# EAGLE design OwlModular (EAGLE 7.5.0)
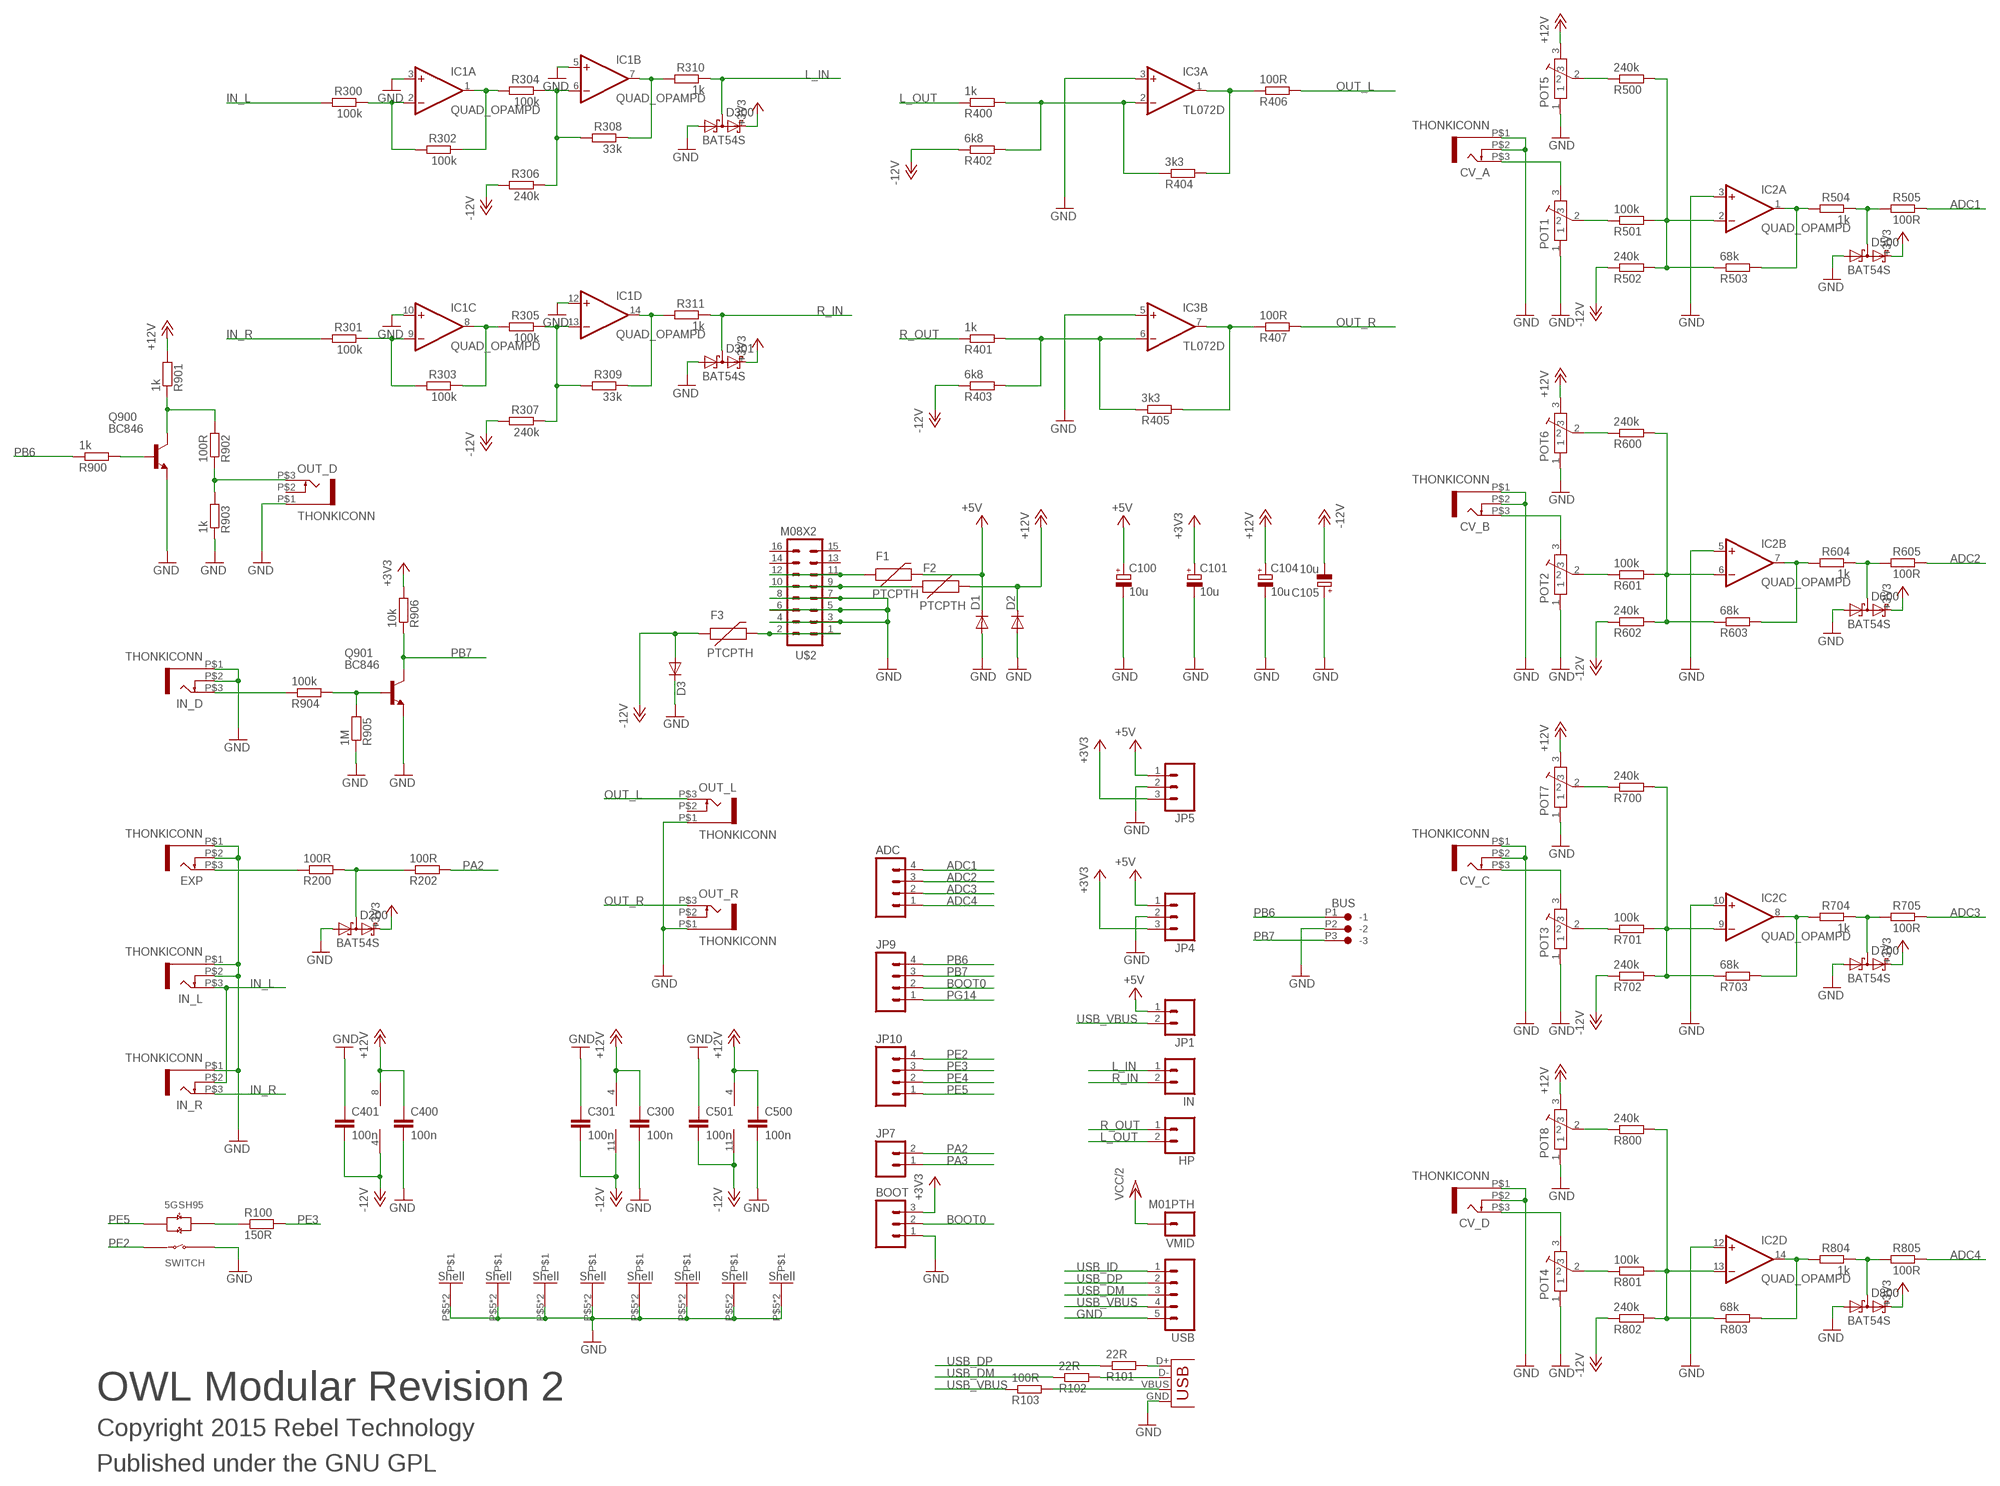
[diagram p0: schematic, sheet 1]

## Parts
ADC  M04PTH  [1X04]
BOOT  M03PTH  [1X03]
BUS  CON-JST_PH_3W  [CON-JST_PH_3W]
C100  10u  CPOL-EUA  [PANASONIC_A]
C101  10u  CPOL-EUA  [PANASONIC_A]
C104  10u  CPOL-EUA  [PANASONIC_A]
C105  10u  CPOL-EUA  [PANASONIC_A]
C300  100n  C-EUC0603  [C0603]
C301  100n  C-EUC0603  [C0603]
C400  100n  C-EUC0603  [C0603]
C401  100n  C-EUC0603  [C0603]
C500  100n  C-EUC0603  [C0603]
C501  100n  C-EUC0603  [C0603]
CV_A  THONKICONN  [THONKICONN]
CV_B  THONKICONN  [THONKICONN]
CV_C  THONKICONN  [THONKICONN]
CV_D  THONKICONN  [THONKICONN]
D1  DIODE1N4001  [DIODE-1N4001]
D2  DIODE1N4001  [DIODE-1N4001]
D3  DIODE1N4001  [DIODE-1N4001]
D200  BAT54S  [SOT23]
D300  BAT54S  [SOT23]
D301  BAT54S  [SOT23]
D500  BAT54S  [SOT23]
D600  BAT54S  [SOT23]
D700  BAT54S  [SOT23]
D800  BAT54S  [SOT23]
EXP  THONKICONN  [THONKICONN]
F1  PTCPTH  [PTC]
F2  PTCPTH  [PTC]
F3  PTCPTH  [PTC]
HP  M02PTH  [1X02]
IC1  QUAD_OPAMPD  [SO14]
IC2  QUAD_OPAMPD  [SO14]
IC3  TL072D  [SO08]
IN  M02PTH  [1X02]
IN_D  THONKICONN  [THONKICONN]
IN_L  THONKICONN  [THONKICONN]
IN_R  THONKICONN  [THONKICONN]
JP1  M02PTH  [1X02]
JP4  M03PTH  [1X03]
JP5  M03PTH  [1X03]
JP7  M02PTH  [1X02]
JP9  M04PTH  [1X04]
JP10  M04PTH  [1X04]
OUT_D  THONKICONN  [THONKICONN]
OUT_L  THONKICONN  [THONKICONN]
OUT_R  THONKICONN  [THONKICONN]
POT1  POT-ALPS-RK09L1140  [POT-ALPS-RK09L1140]
POT2  POT-ALPS-RK09L1140  [POT-ALPS-RK09L1140]
POT3  POT-ALPS-RK09L1140  [POT-ALPS-RK09L1140]
POT4  POT-ALPS-RK09L1140  [POT-ALPS-RK09L1140]
POT5  POT-ALPS-RK09L1140  [POT-ALPS-RK09L1140]
POT6  POT-ALPS-RK09L1140  [POT-ALPS-RK09L1140]
POT7  POT-ALPS-RK09L1140  [POT-ALPS-RK09L1140]
POT8  POT-ALPS-RK09L1140  [POT-ALPS-RK09L1140]
Q900  BC846  [SOT23]
Q901  BC846  [SOT23]
R100  150R  R-EU_0603  [0603]
R101  22R  R-EU_0603  [0603]
R102  22R  R-EU_0603  [0603]
R103  100R  R-EU_0603  [0603]
R200  100R  R-EU_0603  [0603]
R202  100R  R-EU_0603  [0603]
R300  100k  R-EU_0603  [0603]
R301  100k  R-EU_0603  [0603]
R302  100k  R-EU_0603  [0603]
R303  100k  R-EU_0603  [0603]
R304  100k  R-EU_0603  [0603]
R305  100k  R-EU_0603  [0603]
R306  240k  R-EU_0603  [0603]
R307  240k  R-EU_0603  [0603]
R308  33k  R-EU_0603  [0603]
R309  33k  R-EU_0603  [0603]
R310  1k  R-EU_0603  [0603]
R311  1k  R-EU_0603  [0603]
R400  1k  R-EU_0603  [0603]
R401  1k  R-EU_0603  [0603]
R402  6k8  R-EU_0603  [0603]
R403  6k8  R-EU_0603  [0603]
R404  3k3  R-EU_0603  [0603]
R405  3k3  R-EU_0603  [0603]
R406  100R  R-EU_0603  [0603]
R407  100R  R-EU_0603  [0603]
R500  240k  R-EU_0603  [0603]
R501  100k  R-EU_0603  [0603]
R502  240k  R-EU_0603  [0603]
R503  68k  R-EU_0603  [0603]
R504  1k  R-EU_0603  [0603]
R505  100R  R-EU_0603  [0603]
R600  240k  R-EU_0603  [0603]
R601  100k  R-EU_0603  [0603]
R602  240k  R-EU_0603  [0603]
R603  68k  R-EU_0603  [0603]
R604  1k  R-EU_0603  [0603]
R605  100R  R-EU_0603  [0603]
R700  240k  R-EU_0603  [0603]
R701  100k  R-EU_0603  [0603]
R702  240k  R-EU_0603  [0603]
R703  68k  R-EU_0603  [0603]
R704  1k  R-EU_0603  [0603]
R705  100R  R-EU_0603  [0603]
R800  240k  R-EU_0603  [0603]
R801  100k  R-EU_0603  [0603]
R802  240k  R-EU_0603  [0603]
R803  68k  R-EU_0603  [0603]
R804  1k  R-EU_0603  [0603]
R805  100R  R-EU_0603  [0603]
R900  1k  R-EU_0603  [0603]
R901  1k  R-EU_0603  [0603]
R902  100R  R-EU_0603  [0603]
R903  1k  R-EU_0603  [0603]
R904  100k  R-EU_0603  [0603]
R905  1M  R-EU_0603  [0603]
R906  10k  R-EU_0603  [0603]
U$1  5GTH9  [5GTH9]
U$2  M08X2  [2X8]
USB  M05PTH  [1X05]
VMID  M01PTH  [1X01]
X1  USBPTH-VERTICAL  [USB-B-PTH-VERTICAL]

## Nets
+3V3: BOOT.3 C101.+ D200.2(C2) D300.2(C2) D301.2(C2) D500.2(C2) D600.2(C2) D700.2(C2) D800.2(C2) JP4.3 JP5.3 R906.2
+5V: C100.+ D1.C F1.P$2 JP1.1 JP4.1 JP5.1
+12V: C104.+ C300.1 C400.1 C500.1 D2.C F2.P$2 IC1.4(P:V+) IC2.4(P:V+) IC3.8(P:V+) POT5.3 POT6.3 POT7.3 POT8.3 R901.2
-12V: C105.- C301.2 C401.2 C501.2 D3.A F3.P$1 IC1.11(P:V-) IC2.11(P:V-) IC3.4(P:V-) R306.2 R307.2 R402.1 R403.1 R502.1 R602.1 R702.1 R802.1
ADC1: ADC.4 R505.1
ADC2: ADC.3 R605.1
ADC3: ADC.2 R705.1
ADC4: ADC.1 R805.1
BOOT0: BOOT.2 JP9.2
GND: BOOT.1 BUS.P2(-2) C100.- C101.- C104.- C105.+ C300.2 C301.1 C400.2 C401.1 C500.2 C501.1 CV_A.P$1 CV_A.P$2 CV_B.P$1 CV_B.P$2 CV_C.P$1 CV_C.P$2 CV_D.P$1 CV_D.P$2 D1.A D2.A D3.C D200.1(A1) D300.1(A1) D301.1(A1) D500.1(A1) D600.1(A1) D700.1(A1) D800.1(A1) EXP.P$1 EXP.P$2 IC1.3(A:+IN) IC1.5(B:+IN) IC1.10(C:+IN) IC1.12(D:+IN) IC2.3(A:+IN) IC2.5(B:+IN) IC2.10(C:+IN) IC2.12(D:+IN) IC3.3(A:+IN) IC3.5(B:+IN) IN_D.P$1 IN_D.P$2 IN_L.P$1 IN_L.P$2 IN_R.P$1 JP4.2 JP5.2 OUT_D.P$1 OUT_L.P$1 OUT_R.P$1 POT1.1 POT1.P$5 POT1.P$6 POT2.1 POT2.P$5 POT2.P$6 POT3.1 POT3.P$5 POT3.P$6 POT4.1 POT4.P$5 POT4.P$6 POT5.1 POT5.P$5 POT5.P$6 POT6.1 POT6.P$5 POT6.P$6 POT7.1 POT7.P$5 POT7.P$6 POT8.1 POT8.P$5 POT8.P$6 Q900.2(E) Q901.2(E) R903.1 R905.1 U$1.1(SWITCH_B) U$2.3 U$2.4 U$2.5 U$2.6 U$2.7 U$2.8 USB.5 X1.GND
IN_L: IN_L.P$3 IN_R.P$2 R300.2
IN_R: IN_R.P$3 R301.2
L_IN: D300.3(C1A2) IN.1 R310.1
L_OUT: HP.2 R400.1
N$1: IC1.1(A:OUT) R302.1 R304.2
N$2: CV_A.P$3 POT1.3
N$3: POT1.2 R501.1
N$4: IC1.8(C:OUT) R303.1 R305.2
N$5: IC1.9(C:-IN) R301.1 R303.2
N$6: F3.P$2 U$2.1 U$2.2
N$7: IC1.13(D:-IN) R305.1 R307.1 R309.2
N$9: IC1.2(A:-IN) R300.1 R302.2
N$10: R100.1 U$1.+3(LED_R+)
N$12: D200.3(C1A2) R200.2 R202.1
N$13: IC2.2(A:-IN) R500.2 R501.2 R502.2 R503.1
N$14: POT5.2 R500.1
N$16: D500.3(C1A2) R504.1 R505.2
N$17: IC2.1(A:OUT) R503.2 R504.2
N$18: CV_B.P$3 POT2.3
N$19: POT2.2 R601.1
N$20: IC2.6(B:-IN) R600.2 R601.2 R602.2 R603.1
N$21: POT6.2 R600.1
N$22: IC2.7(B:OUT) R603.2 R604.2
N$23: D600.3(C1A2) R604.1 R605.2
N$24: CV_C.P$3 POT3.3
N$25: POT3.2 R701.1
N$26: IC2.9(C:-IN) R700.2 R701.2 R702.2 R703.1
N$27: POT7.2 R700.1
N$28: IC2.8(C:OUT) R703.2 R704.2
N$29: D700.3(C1A2) R704.1 R705.2
N$30: CV_D.P$3 POT4.3
N$31: POT4.2 R801.1
N$32: IC1.6(B:-IN) R304.1 R306.1 R308.2
N$33: IC2.13(D:-IN) R800.2 R801.2 R802.2 R803.1
N$34: POT8.2 R800.1
N$35: IC2.14(D:OUT) R803.2 R804.2
N$36: D800.3(C1A2) R804.1 R805.2
N$37: Q901.1(B) R904.2 R905.2
N$38: EXP.P$3 R200.1
N$39: IC3.1(A:OUT) R404.2 R406.1
N$40: IC3.7(B:OUT) R405.2 R407.1
N$41: IC3.2(A:-IN) R400.2 R402.2 R404.1
N$42: IC3.6(B:-IN) R401.2 R403.2 R405.1
N$44: F1.P$1 U$2.11 U$2.12
N$45: F2.P$1 U$2.9 U$2.10
N$46: IN_D.P$3 R904.1
N$48: Q900.3(C) R901.1 R902.2
N$49: OUT_D.P$3 R902.1 R903.2
N$50: Q900.1(B) R900.2
N$51: R101.2 X1.D+
N$52: R102.2 X1.D-
N$53: IC1.14(D:OUT) R309.1 R311.2
N$54: R103.2 X1.VBUS
N$55: IC1.7(B:OUT) R308.1 R310.2
OUT_L: OUT_L.P$3 R406.2
OUT_R: OUT_R.P$3 R407.2
PA2: JP7.2 R202.2
PA3: JP7.1
PB6: BUS.P1(-1) JP9.4 R900.1
PB7: BUS.P3(-3) JP9.3 Q901.3(C) R906.1
PE2: JP10.4 U$1.4(SWITCH_A)
PE3: JP10.3 R100.2
PE4: JP10.2
PE5: JP10.1 U$1.-2(LED_G+)
PG14: JP9.1
R_IN: D301.3(C1A2) IN.2 R311.1
R_OUT: HP.1 R401.1
USB_DM: R102.1 USB.3
USB_DP: R101.1 USB.2
USB_ID: USB.1
USB_VBUS: JP1.2 R103.1 USB.4
VCC/2: VMID.1
Unconnected: OUT_D.P$2 OUT_L.P$2 OUT_R.P$2 U$2.13 U$2.14 U$2.15 U$2.16

## Notes on the sheet
- OWL Modular Revision 2
- Copyright 2015 Rebel Technology
- Published under the GNU GPL

## Library data of the parts
ADC JP9 JP10 = SparkFun:M04: Header 4 Standard 4-pin 0.1" header. Use with straight break away headers (SKU : PRT-00116), right angle break away headers (PRT-00553), swiss pins (PRT-00743), machine pins (PRT-00117), and female headers (PRT-00115). Molex polarized connector foot print use with SKU : PRT-08231 with associated crimp pins and housings. 1MM SMD Version SKU: PRT-10208
BOOT JP4 JP5 = SparkFun:M03: Header 3 Standard 3-pin 0.1" header. Use with straight break away headers (SKU : PRT-00116), right angle break away headers (PRT-00553), swiss pins (PRT-00743), machine pins (PRT-00117), and female headers (PRT-00115). Molex polarized connector foot print use with SKU : PRT-08232 with associated crimp pins and housings.
BUS = Rebel:CON-JST_PH_3W
C100 C101 C104 C105 = resistor:CPOL-EU: POLARIZED CAPACITOR, European symbol
C300 C301 C400 C401 C500 C501 = resistor:C-EU: CAPACITOR, European symbol
CV_A CV_B CV_C CV_D EXP IN_D IN_L IN_R OUT_D OUT_L OUT_R = Rebel:THONKICONN
D1-D3 = Rebel:DIODE: Diode These are standard reverse protection diodes and small signal diodes. SMA package can handle up to about 1A. SOD-323 can handle about 200mA. Watch the SOD-323 package when ordering, there are some mfgs out there that are 5-pin packages.
D200 D300 D301 D500 D600 D700 D800 = diode:BAT54S: Schottky Diodes Pin connection corrected 2011-05-04 Source: Fairchild .. BAT54.pdf
F1-F3 = Rebel:PTC: Resettable Fuse PTC Resettable Fuse. Bourns MF-R, Raychem PolySwitch RXE.
HP IN JP1 JP7 = SparkFun:M02: Header 2 Standard 2-pin 0.1" header. Use with straight break away headers (SKU : PRT-00116), right angle break away headers (PRT-00553), swiss pins (PRT-00743), machine pins (PRT-00117), and female headers (PRT-00115). Molex polarized connector foot print use with SKU : PRT-08233 with associated crimp pins and housings.
IC1 IC2 = adafruit:QUAD_OPAMP: OP AMP Standard quad package
IC3 = linear:TL072: OP AMP
POT1-POT8 = Rebel:POT-ALPS-RK09L
Q900 Q901 = transistor:BC846: NPN TRANSISTOR
R100-R103 R200 R202 R300-R311 R400-R407 R500-R505 R600-R605 R700-R705 R800-R805 R900-R906 = Rebel:R-EU_: RESISTOR, European symbol
U$1 = SWITCH-5GTH9:5GTH9
U$2 = SparkFun:M08X2
USB = SparkFun:M05: Header 5 Standard 5-pin 0.1" header. Use with straight break away headers (SKU : PRT-00116), right angle break away headers (PRT-00553), swiss pins (PRT-00743), machine pins (PRT-00117), and female headers (PRT-00115). Molex polarized connector foot print use with SKU : PRT-08230 with associated crimp pins and housings.
VMID = SparkFun:M01: Header 1 Standard 1-pin 0.1" header. Use with straight break away headers (SKU : PRT-00116), right angle break away headers (PRT-00553), swiss pins (PRT-00743), machine pins (PRT-00117), and female headers (PRT-00115).
X1 = SparkFun:USB: USB Connectors USB-B-PTH is fully proven SKU : PRT-00139 USB-miniB is fully proven SKU : PRT-00587 USB-A-PCB is untested. USB-A-H is throughly reviewed, but untested. Spark Fun Electronics SKU : PRT-00437 USB-B-SMT is throughly reviewed, but untested. Needs silkscreen touching up. USB-A-S has not been used/tested USB-MB-H has not been used/tested

## Board
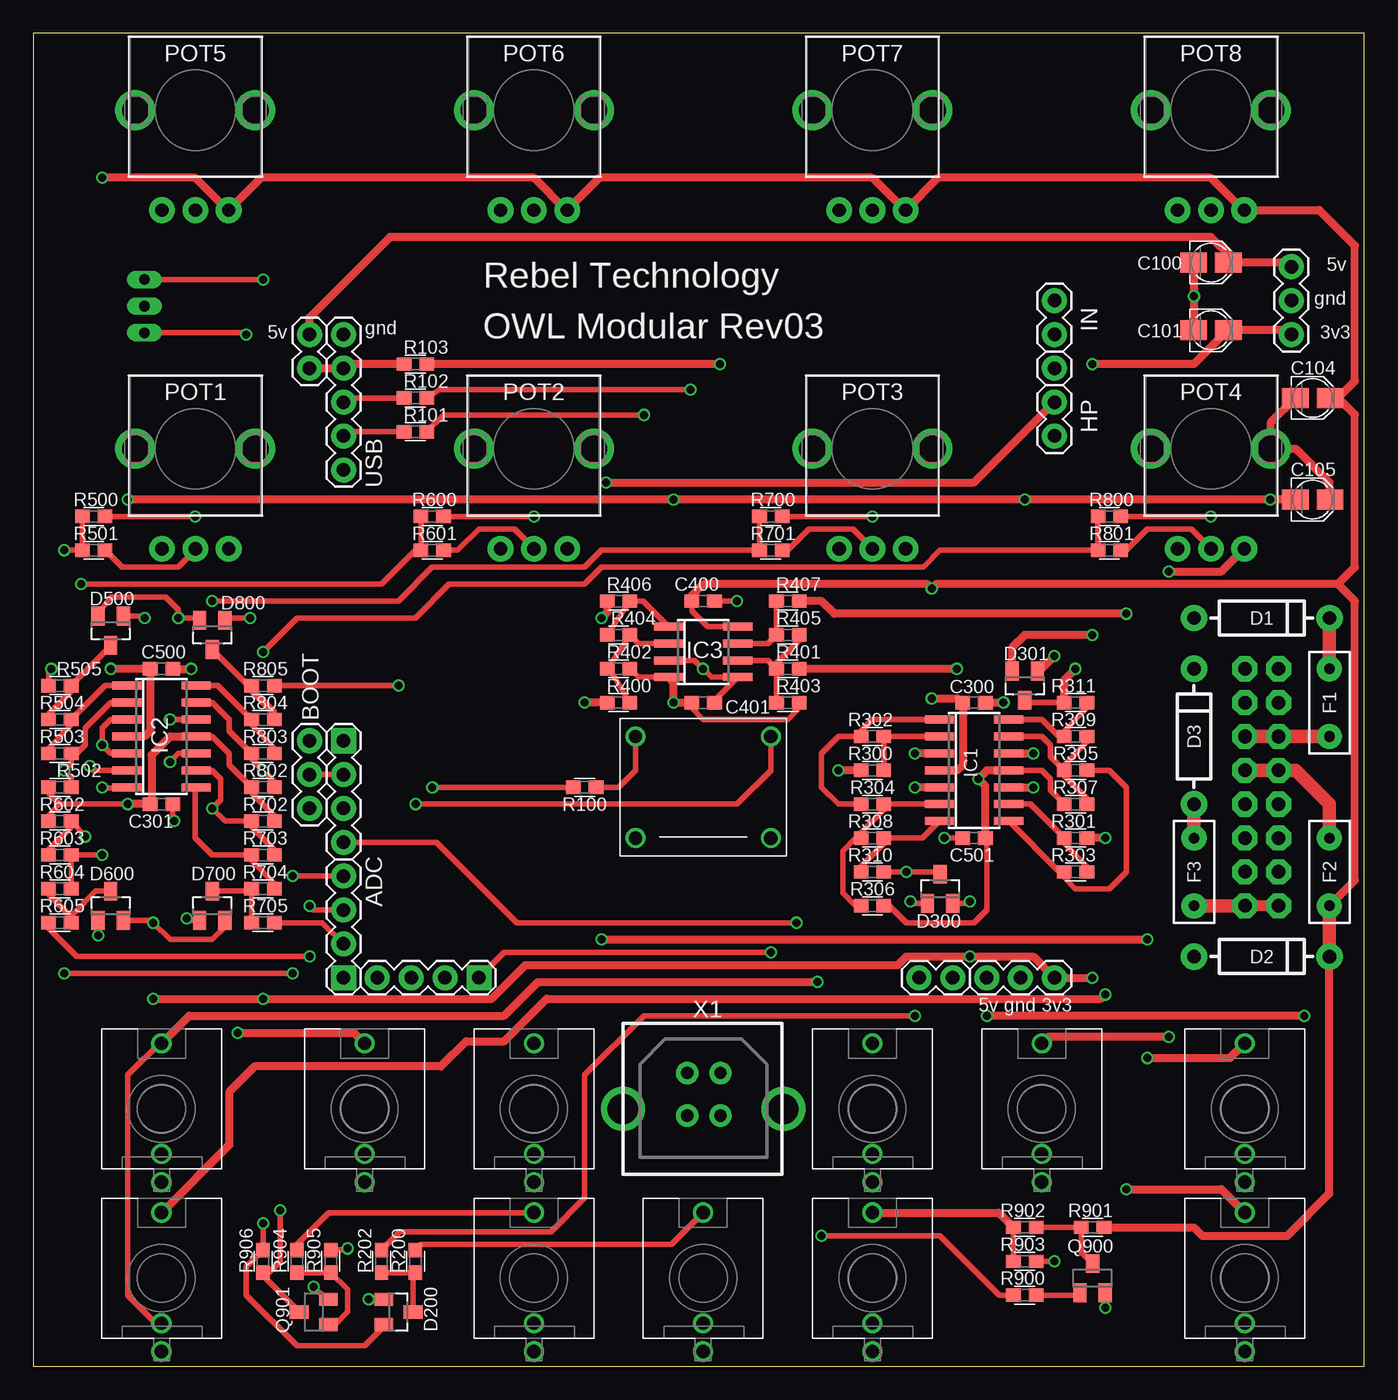
[diagram p1: board, top side]
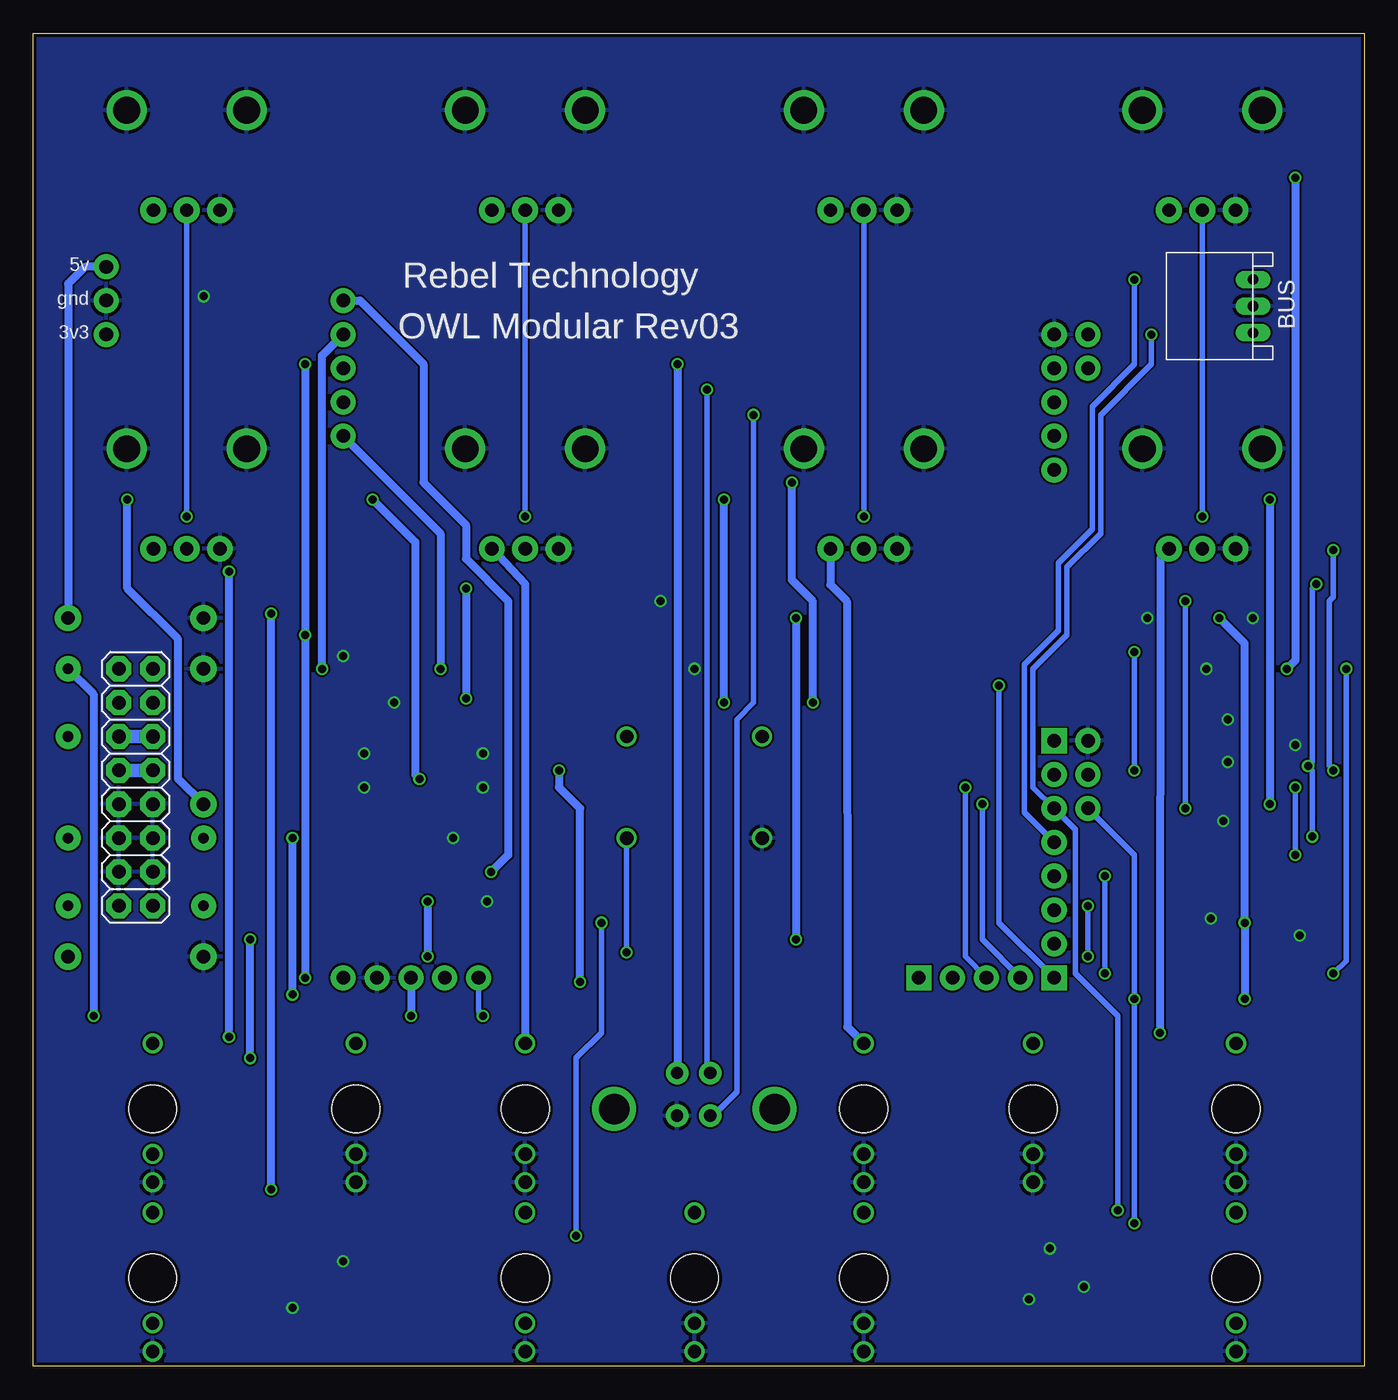
[diagram p2: board, bottom side, seen from below]

Size 99.86 x 100 mm. Coordinates in mm from the lower left corner, seen from the top.
Outline: 0,0 99.86,0 99.86,100 0,100 0,0
Copper layers (1*16): Top 0.035mm / dielectric 1.5mm / Bottom 0.035mm
Design rules "SeeedStudio_2layer_DRU_no_angle_20140221": minimum track width 6mil, minimum drill 12mil, track to track 6mil, track to pad 6mil, pad to pad 6mil, via to via 6mil, smd to smd 0mil, copper to edge 10mil, drill to drill 10mil, minimum pad ring 10mil, minimum via ring 6mil, stop-mask expansion 2mil, vias tented up to drill 100mil, thermal gap 10mil

### Footprints (pad centres in the part's own frame; a part is rotated, then mirrored left to right if it is on the bottom)
1X04 = drill 1.016 pad 1.88 square: 1 0,0 | drill 1.016 pad 1.88: 2 2.54,0; 3 5.08,0; 4 7.62,0
1X03 = drill 1.016 pad 1.88: 1 0,0; 2 2.54,0; 3 5.08,0
CON-JST_PH_3W = drill 0.8 long: P1 0,0; P2 -2,0; P3 -4,0
PANASONIC_A = smd 2 x 1.5: + 1.3,0; - -1.3,0
C0603 = smd 1.1 x 1: 1 -0.85,0; 2 0.85,0
THONKICONN = drill 1: P$1 0,-5.5; P$2 0,-3.38; P$3 0,4.92 | hole 3.6: 0,0
DIODE-1N4001 = drill 1 pad 1.981: A -5.08,0; C 5.08,0
SOT23 = smd 1 x 1.4: 1 -0.95,-1.1; 2 0.95,-1.1; 3 0,1.1
PTC = drill 0.8 pad 1.88: P$1 -2.54,0; P$2 2.54,0
1X02 = drill 1.016 pad 1.88: 1 0,0; 2 2.54,0
SO14 = smd 0.6 x 2.2: 1 -3.81,-2.6; 2 -2.54,-2.6; 3 -1.27,-2.6; 4 0,-2.6; 5 1.27,-2.6; 6 2.54,-2.6; 7 3.81,-2.6; 8 3.81,2.6; 9 2.54,2.6; 10 1.27,2.6; 11 0,2.6; 12 -1.27,2.6; 13 -2.54,2.6; 14 -3.81,2.6
SO08 = smd 0.6 x 2.2: 1 -1.905,-2.6; 2 -0.635,-2.6; 3 0.635,-2.6; 4 1.905,-2.6; 5 1.905,2.6; 6 0.635,2.6; 7 -0.635,2.6; 8 -1.905,2.6
POT-ALPS-RK09L1140 = drill 1 pad 1.93: 1 -2.5,-7.5; 2 0,-7.5; 3 2.5,-7.5 | drill 2: P$5 -4.5,0; P$6 4.5,0
0603 = smd 1.1 x 1: 1 -0.85,0; 2 0.85,0
5GTH9 = drill 1: 1 5.08,3.81; 4 -5.08,-3.81; +3 5.08,-3.81; -2 -5.08,3.81
2X8 = drill 1.016 pad 1.88 octagon: 1 0,0; 2 0,2.54; 3 2.54,0; 4 2.54,2.54; 5 5.08,0; 6 5.08,2.54; 7 7.62,0; 8 7.62,2.54; 9 10.16,0; 10 10.16,2.54; 11 12.7,0; 12 12.7,2.54; 13 15.24,0; 14 15.24,2.54; 15 17.78,0; 16 17.78,2.54
1X05 = drill 1.016 pad 1.88: 1 0,0; 2 2.54,0; 3 5.08,0; 4 7.62,0; 5 10.16,0
1X01 = drill 1.016 pad 1.88: 1 0,0
USB-B-PTH-VERTICAL = drill 0.914 pad 1.676: D+ -1.194,-0.508; D- -1.194,2.692; GND 1.295,-0.508; VBUS 1.295,2.692 | drill 2.286: P$1 -6.02,0; P$2 6.02,0

### Placement (x,y rotation side)
ADC  23.27,29.15 90 top
BOOT  20.73,46.93 270 top
BUS  8.35,81.53 90 bottom
C100  88.36,82.8 0 top
C101  88.36,77.72 0 top
C104  95.98,72.64 0 top
C105  95.98,65.02 0 top
C300  70.58,49.78 0 top
C301  9.62,42.16 180 top
C400  50.26,57.4 0 top
C401  50.26,49.78 180 top
C500  9.62,52.32 0 top
C501  70.58,39.62 0 top
CV_A  24.86,19.3 0 top
CV_B  37.56,19.3 0 top
CV_C  62.96,19.3 0 top
CV_D  75.66,19.3 0 top
D1  92.17,56.13 0 top
D2  92.17,30.73 0 top
D3  87.09,47.24 90 top
D200  27.4,4.06 270 top
D300  68.04,35.81 0 top
D301  74.39,51.05 180 top
D500  5.81,55.18 180 top
D600  5.81,34.54 0 top
D700  13.43,34.54 0 top
D800  13.43,54.86 180 top
EXP  50.26,6.6 0 top
F1  97.25,49.78 90 top
F2  97.25,37.08 270 top
F3  87.09,37.08 270 top
HP  76.61,69.79 90 top
IC1  70.58,44.7 270 top
IC2  9.62,47.24 270 top
IC3  50.26,53.59 270 top
IN  76.61,79.95 270 top
IN_D  37.56,6.6 0 top
IN_L  9.62,19.3 0 top
IN_R  9.62,6.6 0 top
JP1  20.73,77.41 270 top
JP4  94.39,82.49 270 top
JP5  71.53,29.15 0 top
JP7  68.99,29.15 180 top
JP9  23.27,46.93 270 top
JP10  33.43,29.15 180 top
OUT_D  62.96,6.6 0 top
OUT_L  90.9,19.3 0 top
OUT_R  90.9,6.6 0 top
POT1  12.16,68.83 0 top
POT2  37.56,68.83 0 top
POT3  62.96,68.83 0 top
POT4  88.36,68.83 0 top
POT5  12.16,94.23 0 top
POT6  37.56,94.23 0 top
POT7  62.96,94.23 0 top
POT8  88.36,94.23 0 top
Q900  79.47,6.6 0 top
Q901  21.05,4.06 90 top
R100  41.37,43.43 180 top
R101  28.67,70.1 0 top
R102  28.67,72.64 0 top
R103  28.67,75.18 0 top
R200  28.67,7.87 270 top
R202  26.13,7.87 90 top
R300  62.96,44.7 180 top
R301  78.2,39.62 0 top
R302  62.96,47.24 0 top
R303  78.2,37.08 0 top
R304  62.96,42.16 180 top
R305  78.2,44.7 0 top
R306  62.96,34.54 0 top
R307  78.2,42.16 180 top
R308  62.96,39.62 180 top
R309  78.2,47.24 0 top
R310  62.96,37.08 180 top
R311  78.2,49.78 0 top
R400  43.91,49.78 0 top
R401  56.61,52.32 180 top
R402  43.91,52.32 180 top
R403  56.61,49.78 180 top
R404  43.91,54.86 180 top
R405  56.61,54.86 180 top
R406  43.91,57.4 180 top
R407  56.61,57.4 0 top
R500  4.54,63.75 180 top
R501  4.54,61.21 180 top
R502  2,43.43 0 top
R503  2,45.97 180 top
R504  2,48.51 0 top
R505  2,51.05 0 top
R600  29.94,63.75 180 top
R601  29.94,61.21 180 top
R602  2,40.89 0 top
R603  2,38.35 0 top
R604  2,35.81 0 top
R605  2,33.27 0 top
R700  55.34,63.75 180 top
R701  55.34,61.21 180 top
R702  17.24,40.89 180 top
R703  17.24,38.35 180 top
R704  17.24,35.81 0 top
R705  17.24,33.27 180 top
R800  80.74,63.75 180 top
R801  80.74,61.21 180 top
R802  17.24,43.43 0 top
R803  17.24,45.97 0 top
R804  17.24,48.51 180 top
R805  17.24,51.05 180 top
R900  74.39,5.33 0 top
R901  79.47,10.41 0 top
R902  74.39,10.41 0 top
R903  74.39,7.87 180 top
R904  19.78,7.87 270 top
R905  22.32,7.87 270 top
R906  17.24,7.87 90 top
U$1  50.26,43.43 180 top
U$2  90.9,34.54 90 bottom
USB  23.27,67.25 90 top
VMID  76.61,74.87 90 top
X1  50.26,19.3 0 top

### Tracks (layer width: path | path; a pad name or v marks a point on that pad's centre or on a via)
+3V3  (via drill 0.6)
  Top 0.406: D700.2 14.38,32.95 13.43,32 10.25,32 v8.98,33.27 8.81,33.44 D600.2 | D800.2 12.31,56.13 v10.89,56.13 10.89,56.77 9.93,57.72 5.81,57.72 4.86,56.45 D500.2 | D300.2 70.11,34.71 v70.26,34.86 | D200.2 26.3,2.96 24.86,1.52 19.78,1.52 15.97,5.33 15.97,7.45 R906.2 v17.24,10.73
  Top 0.61: v8.98,27.56 v17.24,27.56 34.38,27.56 36.92,30.1 64.86,30.1 65.5,30.73 v70.26,30.73 75.02,30.73 JP5.3 v79.47,29.15 | JP4.3 94.1,77.72 C101.+ 89.63,77.72 87.09,75.18 v79.47,75.18 | v79.47,54.86 74.39,54.86 73.43,53.91 D301.2
  Bottom 0.406: v17.24,10.73 v17.24,27.56 17.24,38.35 BOOT.3
  Bottom 0.61: v79.47,29.15 v79.47,54.86 v79.47,75.18 | v8.98,27.56 v8.98,33.27 8.98,54.23 v10.89,56.13 | v70.26,34.86 v70.26,30.73
+5V  (via drill 0.6)
  Top 0.61: v95.34,26.29 v71.53,26.29 | JP4.1 94.1,82.8 C100.+ 89.94,83.09 89.94,83.12 88.36,84.71 26.76,84.71 20.73,78.68 JP1.1
  Top 1.016: F1.P$2 D1.C
  Bottom 0.61: v95.34,26.29 95.34,50.42 F1.P$2 | JP4.1 95.98,82.49 97.25,81.22 D1.C | JP5.1 v71.53,26.29
+12V  (via drill 0.6)
  Top 0.406: IC3.8 50.57,55.5 49.41,56.67 C400.1
  Top 0.61: F2.P$2 99.15,36.45 99.15,57.4 97.88,58.67 | 97.88,58.67 67.72,58.67 v67.4,58.36 67.08,58.67 50.26,58.67 49.41,57.82 C400.1 | 97.88,58.67 99.15,59.94 99.15,71.4 97.91,72.64 C104.+ 97.91,72.67 99.15,73.91 99.15,84.07 96.49,86.73 POT8.3 90.78,86.73 88.36,89.15 67.88,89.15 POT7.3 65.38,86.73 62.96,89.15 42.48,89.15 POT6.3 39.98,86.73 37.56,89.15 17.08,89.15 POT5.3 14.58,86.73 12.16,89.15 v5.17,89.15 | IC2.4 8.35,47.24 8.77,47.66 C500.1 v5.81,52.32 | IC1.4 69.31,44.7 69.73,45.12 C300.1 69.31,50.1 v67.4,50.1 | R901.2 87.09,10.41 87.72,9.78 94.07,9.78 97.25,12.95 D2.C
  Top 1.016: F2.P$2 D2.C
  Bottom 0.61: v5.17,89.15 5.17,52.96 v5.81,52.32 | v67.4,58.36 v67.4,50.1
-12V  (via drill 0.6)
  Top 0.406: IC2.11 13.43,47.24 14.7,45.97 14.7,45.12 R802.1 16.39,43.01 18.09,41.31 R702.1 | R602.1 1.15,41.31 2,42.16 | 2,42.16 v7.08,42.16 | R502.1 1.15,43.01 2,42.16 | R306.2 64.23,34.54 65.5,33.27 70.58,33.27 71.53,34.23 71.53,39.52 C501.2 | IC3.4 45.39,51.69 R402.1 | R403.1 57.46,49.36 56.61,48.51 50.26,48.51 49.41,49.36 C401.2 | IC1.11 75.66,44.7 76.29,44.07 76.29,43.22 R307.2
  Top 0.61: C105.- v92.8,65.02 v74.39,65.02 v48.03,65.02 v7.08,65.02 | IC2.11 10.25,47.24 8.88,45.87 8.88,42.28 C301.2 v7.08,42.16 | IC3.4 48.03,51.31 v48.03,49.78 C401.2 | C501.2 71.43,43.54 v70.89,44.07 71.53,44.7 IC1.11
  Top 1.016: F3.P$1 D3.A
  Bottom 0.61: v7.08,65.02 v7.08,42.16 | D3.A 88.99,44.07 88.99,54.55 92.8,58.36 v92.8,65.02 | v70.89,44.07 71.21,44.39 71.21,61.85 v74.39,65.02 | v48.03,49.78 v48.03,65.02
ADC1  (via drill 0.6)
  Top 0.406: v19.46,29.46 v2.31,29.46 | R505.1 1.15,52.22 v1.36,52.32 | ADC.4 v19.46,36.77
  Bottom 0.406: v19.46,36.77 v19.46,29.46 | v1.36,52.32 1.36,30.42 v2.31,29.46
ADC2  (via drill 0.6)
  Top 0.406: R605.1 1.15,32.85 3.27,30.73 v20.73,30.73 | ADC.3 21.05,34.23 v20.73,34.54
  Bottom 0.406: v20.73,30.73 v20.73,34.54
ADC3
  Top 0.406: R705.1 21.68,33.27 ADC.2
ADC4  (via drill 0.6)
  Top 0.406: R805.1 v27.4,51.05
  Bottom 0.406: v27.4,51.05 27.4,33.27 ADC.1
BOOT0
  Top 0.406: BOOT.2 JP9.2
GND  (via drill 0.6)
  Top 0.406: D600.1 4.86,32.95 v4.85,32.32 | D700.1 11.67,33.44 v11.52,33.59 | D500.1 8.18,56.28 v8.35,56.13 | D800.1 14.69,56.14 v16.28,56.13 | IC2.3 5.81,48.51 5.17,47.88 v5.17,46.61 5.81,45.97 IC2.5 | IC2.12 v10.25,48.51 | IC2.10 10.89,45.97 v10.25,45.34 | C301.1 10.47,41.31 v10.57,40.89 | R903.1 v76.61,7.87 | Q900.2 v80.42,4.38 | C501.1 v68.35,39.62 | D300.1 65.96,34.71 v65.81,34.86 | IC3.3 49.62,52.96 v50.26,52.32 50.89,51.69 IC3.5 51.11,49.94 C401.1 | C400.2 v52.8,57.4 | Q901.2 22,5.01 v21.05,5.97 | D200.1 v25.18,5.01 v25.17,5.02 | R905.1 23.48,8.72 v23.59,8.83
  Top 0.61: C100.- 87.06,80.29 v87.09,80.26 87.09,77.75 C101.- | C104.- 92.86,70.82 POT4.P$6 94.71,68.83 97.25,66.29 97.25,65.05 C105.+ | C500.2 v11.84,52.32 | D301.1 75.49,52.15 v76.61,53.28 | IC1.12 v75.02,45.97 | IC1.10 v75.02,43.43 | C300.2 v72.8,49.78 | IC1.3 v66.13,45.97 | IC1.5 v66.13,43.43
  pour Bottom: -8.16,-1.65 -8.16,102.49 108.36,102.49 108.36,-1.65
IN_L  (via drill 0.6)
  Top 0.406: IN_R.P$2 9.19,3.22 7.08,5.33 7.08,21.84 9.62,24.38 IN_L.P$3
  Top 0.61: R300.2 v60.42,44.7 | v58.83,28.83 37.87,28.83 35.33,26.29 11.68,26.29 IN_L.P$3
  Bottom 0.61: v60.42,44.7 60.42,43.43 58.83,41.85 v58.83,28.83
IN_R  (via drill 0.6)
  Top 0.61: v80.42,27.88 80.1,27.56 38.51,27.56 35.33,24.38 32.48,24.38 30.57,22.48 16.6,22.48 14.7,20.57 14.7,16.6 IN_R.P$3 | v80.42,39.62 R301.2
  Bottom 0.61: v80.42,27.88 v80.42,39.62
L_IN  (via drill 0.6)
  Top 0.406: R310.1 v65.5,37.08 67.87,37.08 D300.3
  Bottom 0.61: IN.1 75.34,79.95 70.58,75.18 70.58,66.29 67.4,63.12 67.4,60.58 64.23,57.4 64.23,38.35 v65.5,37.08
L_OUT  (via drill 0.6)
  Top 0.61: R400.1 v41.37,49.78 | v42.95,66.29 70.58,66.29 HP.2
  Bottom 0.61: v41.37,49.78 41.37,57.4 42.95,58.99 v42.95,66.29
N$1
  Top 0.406: 67.98,48.57 IC1.1 62.96,48.51 62.11,47.66 R302.1 60.42,47.24 59.15,45.97 59.15,43.43 60.42,42.16 R304.2
N$2  (via drill 0.6)
  Top 0.61: v15.33,25.02 24.06,25.02 CV_A.P$3
  Bottom 0.61: v15.33,25.02 15.29,60.62 14.66,61.25 POT1.3
N$3
  Top 0.406: POT1.2 12.16,61.21 10.89,59.94 6.66,59.94 R501.1
N$4
  Top 0.406: R305.2 80.74,44.7 82.01,43.43 82.01,37.08 80.74,35.81 78.2,35.81 77.35,36.66 R303.1 76.99,37.08 IC1.8
N$5
  Top 0.406: R303.2 79.05,37.5 77.35,39.2 R301.1 74.81,42.16 IC1.9
N$6
  Top 0.813: U$2.2 U$2.1
  Top 1.016: U$2.1 F3.P$2
N$7
  Top 0.406: R309.2 79.05,46.82 77.35,45.12 R305.1 | R305.1 77.35,44.28 79.05,42.58 R307.1 | IC1.13 75.66,47.24 76.29,46.61 76.29,45.76 R305.1
N$9
  Top 0.406: IC1.2 R302.2 R300.1
N$10
  Top 0.406: R100.1 43.91,43.43 45.18,44.7 U$1.+3
N$12
  Top 0.406: R202.1 R200.2 28.5,6.85 D200.3
N$13  (via drill 0.6)
  Top 0.406: IC2.2 5.81,49.78 3.9,47.88 3.9,46.61 3.27,45.97 R503.1 2.85,45.24 v2.31,44.7 2.85,44.17 R502.2 | R500.2 R501.2 v2.31,61.21
  Bottom 0.406: v2.31,61.21 2.31,57.72 2.63,57.4 2.63,45.02 v2.31,44.7
N$14  (via drill 0.6)
  Top 0.406: v12.16,63.75 R500.1
  Bottom 0.406: POT5.2 v12.16,63.75
N$16
  Top 0.406: R504.1 1.15,48.93 2.85,50.63 R505.2 5.56,53.76 D500.3
N$17
  Top 0.406: IC2.1 5.39,51.05 R504.2 2.85,48.09 1.15,46.39 R503.2
N$18
  Bottom 0.61: POT2.3 40.06,58.63 38.83,57.4 38.79,25.45 CV_B.P$3
N$19
  Top 0.406: R601.1 31.84,61.21 33.43,62.8 36.09,62.8 POT2.2
N$20  (via drill 0.6)
  Top 0.406: R603.1 1.15,38.77 2.85,40.47 R602.2 v3.9,39.73 | v4.22,45.02 4.54,44.7 IC2.6 | R600.2 R601.2 28.67,61.21 26.13,58.67 v3.58,58.67
  Bottom 0.406: v3.58,58.67 3.9,58.36 3.9,45.34 v4.22,45.02 3.9,44.7 v3.9,39.73
N$21  (via drill 0.6)
  Top 0.406: v37.56,63.75 R600.1
  Bottom 0.406: POT6.2 v37.56,63.75
N$22  (via drill 0.6)
  Top 0.406: R603.2 3.27,38.35 | IC2.7 7.08,43.37 5.43,43.37 v5.17,43.43 | R604.2 R603.2 | v5.17,38.35 R603.2
  Bottom 0.406: v5.17,43.43 v5.17,38.35
N$23
  Top 0.406: R604.1 1.15,35.39 2.85,33.69 R605.2 2.95,33.38 2.95,33.91 4.68,35.64 D600.3
N$24
  Bottom 0.61: POT3.3 62.96,58.67 CV_C.P$3
N$25
  Top 0.406: R701.1 56.61,61.21 58.19,62.8 61.49,62.8 POT3.2
N$26  (via drill 0.6)
  Top 0.406: R700.2 R701.2 42.64,61.21 41.37,59.94 29.94,59.94 27.4,57.4 v13.43,57.4 | R703.1 18.09,38.77 16.39,40.47 R702.2 14.38,40.89 v13.43,41.85 14.06,42.48 14.06,44.07 13.43,44.7 IC2.9
  Bottom 0.406: v13.43,57.4 v13.43,41.85
N$27  (via drill 0.6)
  Top 0.406: v62.96,63.75 R700.1
  Bottom 0.406: POT7.2 v62.96,63.75
N$28
  Top 0.406: IC2.8 12.16,43.37 12.16,39.62 13.43,38.35 R703.2 16.39,37.93 18.09,36.23 R704.2
N$29
  Top 0.406: D700.3 16.22,35.64 R704.1 15.97,35.81 16.39,35.39 R705.2
N$30  (via drill 0.6)
  Top 0.61: v85.18,59.63 89.15,59.63 POT4.3 | v85.18,24.7 76.13,24.7 CV_D.P$3
  Bottom 0.61: v85.18,24.7 v85.18,59.63
N$31
  Top 0.406: R801.1 82.01,61.21 83.59,62.8 86.89,62.8 POT4.2
N$32
  Top 0.406: IC1.6 R304.1 63.81,41.74 62.11,40.04 R308.2 61.69,39.62 60.73,38.67 60.73,35.5 61.69,34.54 R306.1
N$33  (via drill 0.6)
  Top 0.406: IC2.13 13.43,49.78 14.7,48.51 14.7,47.66 R803.1 16.39,45.55 v17.24,44.7 18.09,43.85 R802.2 | v17.24,53.59 19.78,56.13 28.67,56.13 31.21,58.67 41.37,58.67 42.64,59.94 66.77,59.94 68.04,61.21 R801.2 R800.2
  Bottom 0.406: v17.24,53.59 v17.24,44.7
N$34  (via drill 0.6)
  Top 0.406: v88.36,63.75 R800.1
  Bottom 0.406: POT8.2 v88.36,63.75
N$35
  Top 0.406: IC2.14 13.85,51.05 R804.2 16.39,48.09 18.09,46.39 R803.2
N$36
  Top 0.406: R805.2 16.39,50.63 18.09,48.93 R804.1 18.09,49.1 D800.3
N$37
  Top 0.406: Q901.1 22.64,3.11 23.59,4.06 23.59,5.75 R905.2 R904.2
N$38
  Top 0.406: R200.1 29.09,9.14 47.88,9.14 EXP.P$3
N$39
  Top 0.406: R404.2 R406.1 45.75,57.4 IC3.1
N$40
  Top 0.406: R407.1 R405.2 55.12,54.23 IC3.7
N$41
  Top 0.406: R400.2 44.33,50.52 43.49,51.9 R402.2 R404.1 45.39,54.23 IC3.2
N$42
  Top 0.406: IC3.6 55.12,52.96 R401.2 | R401.2 R403.2 | R405.1 57.46,54.44 55.76,52.74 R401.2
N$44
  Top 1.016: U$2.11 F1.P$1
  Bottom 1.016: U$2.12 U$2.11
N$45
  Top 1.016: U$2.9 94.71,44.7 97.25,42.16 F2.P$1
  Bottom 1.016: U$2.10 U$2.9
N$46
  Top 0.406: IN_D.P$3 22.16,11.52 19.78,9.14 R904.1
N$48
  Top 0.406: R902.2 R901.1 78.62,8.55 Q900.3
N$49
  Top 0.406: R903.2 R902.1
  Top 0.61: OUT_D.P$3 72.43,11.52 R902.1
N$50
  Top 0.406: R900.2 78.35,5.33 Q900.1
N$51  (via drill 0.6)
  Top 0.406: v45.81,71.37 30.79,71.37 R101.2
  Bottom 0.406: X1.D+ 48.86,18.8 47.08,20.57 47.08,48.51 45.81,49.78 v45.81,71.37
N$52  (via drill 0.6)
  Top 0.406: v49.3,73.28 30.47,73.28 R102.2
  Bottom 0.406: X1.D- 49.06,21.92 49.3,22.16 v49.3,73.28
N$53
  Top 0.406: IC1.14 75.66,48.51 76.93,47.24 R309.1 77.35,47.66 79.05,49.36 R311.2
N$54  (via drill 0.6)
  Top 0.61: v51.53,75.18 R103.2
  Bottom 0.61: v51.53,75.18 51.53,22.29 X1.VBUS
N$55
  Top 0.406: IC1.7 66.71,39.62 R308.1 63.81,39.2 62.11,37.5 R310.2
OUT_L  (via drill 0.6)
  Top 0.61: R406.2 43.06,56.55 v42.64,56.13 | v42.64,32 v83.59,32 | v83.59,23.11 89.79,23.11 OUT_L.P$3
  Bottom 0.61: v83.59,23.11 v83.59,32 | v42.64,56.13 v42.64,32
OUT_R  (via drill 0.6)
  Top 0.61: v82.01,56.45 60.1,56.45 59.15,57.4 R407.2 | v82.01,13.27 89.15,13.27 OUT_R.P$3
  Bottom 0.61: v82.01,13.27 v82.01,56.45
PA2  (via drill 0.6)
  Top 0.406: v66.13,26.29 45.81,26.29 41.37,21.84 41.37,12.64 38.83,10.1 27.5,10.1 R202.2
  Bottom 0.406: JP7.2 66.45,26.61 v66.13,26.29
PB6  (via drill 0.6)
  Top 0.406: JP9.4 30.25,39.31 36.29,33.27 v57.24,33.27 | R900.1 72.48,5.33 68.04,9.78 v59.15,9.78 | v17.24,81.53 BUS.P1
  Bottom 0.406: v57.24,33.27 57.24,25.02 59.15,23.11 v59.15,9.78 | JP9.4 25.49,41.53 25.49,52.64 22.95,55.18 22.95,60.26 20.41,62.8 20.41,72.01 17.24,75.18 v17.24,81.53
PB7  (via drill 0.6)
  Top 0.406: Q901.3 17.24,6.77 R906.1 17.66,7.02 18.51,7.87 v18.51,11.68 | BUS.P3 15.84,77.53 v15.97,77.41
  Bottom 0.406: v18.51,11.68 18.51,26.29 21.68,29.46 21.68,40.26 JP9.3 24.86,43.43 24.86,52.32 22.32,54.86 22.32,59.94 19.78,62.48 19.78,71.37 15.97,75.18 v15.97,77.41
PE2  (via drill 0.6)
  Top 0.406: U$1.4 55.34,44.7 52.8,42.16 v28.67,42.16
  Bottom 0.406: v28.67,42.16 28.67,32 JP10.4
PE3  (via drill 0.6)
  Top 0.406: R100.2 v29.94,43.43
  Bottom 0.406: v29.94,43.43 29.94,30.73 JP10.3
PE5  (via drill 0.6)
  Top 0.406: JP10.1 35.33,31.05 v55.34,31.05
  Bottom 0.406: U$1.-2 v55.34,31.05
R_IN  (via drill 0.6)
  Top 0.406: R311.1 74.56,49.78 D301.3
  Top 0.61: R311.1 77.35,51.47 v78.2,52.32
  Bottom 0.61: v78.2,52.32 78.2,75.82 IN.2
R_OUT  (via drill 0.6)
  Top 0.61: v69.31,52.32 R401.1
  Bottom 0.61: HP.1 69.31,62.48 v69.31,52.32
USB_DM
  Top 0.406: R102.1 23.59,72.64 USB.3
USB_DP
  Top 0.406: R101.1 23.59,70.1 USB.2
USB_VBUS
  Top 0.61: JP1.2 USB.4 23.59,75.18 R103.1

### Text on the board
tPlace: 5v | Rebel Technology | gnd | 5v | gnd | OWL Modular Rev03 | 3v3 | 5v | gnd | 3v3
bPlace: 5v | Rebel Technology | gnd | OWL Modular Rev03 | 3v3